# Altium schematic sheet Main.SchDoc
size A3; SheetNumber: 1
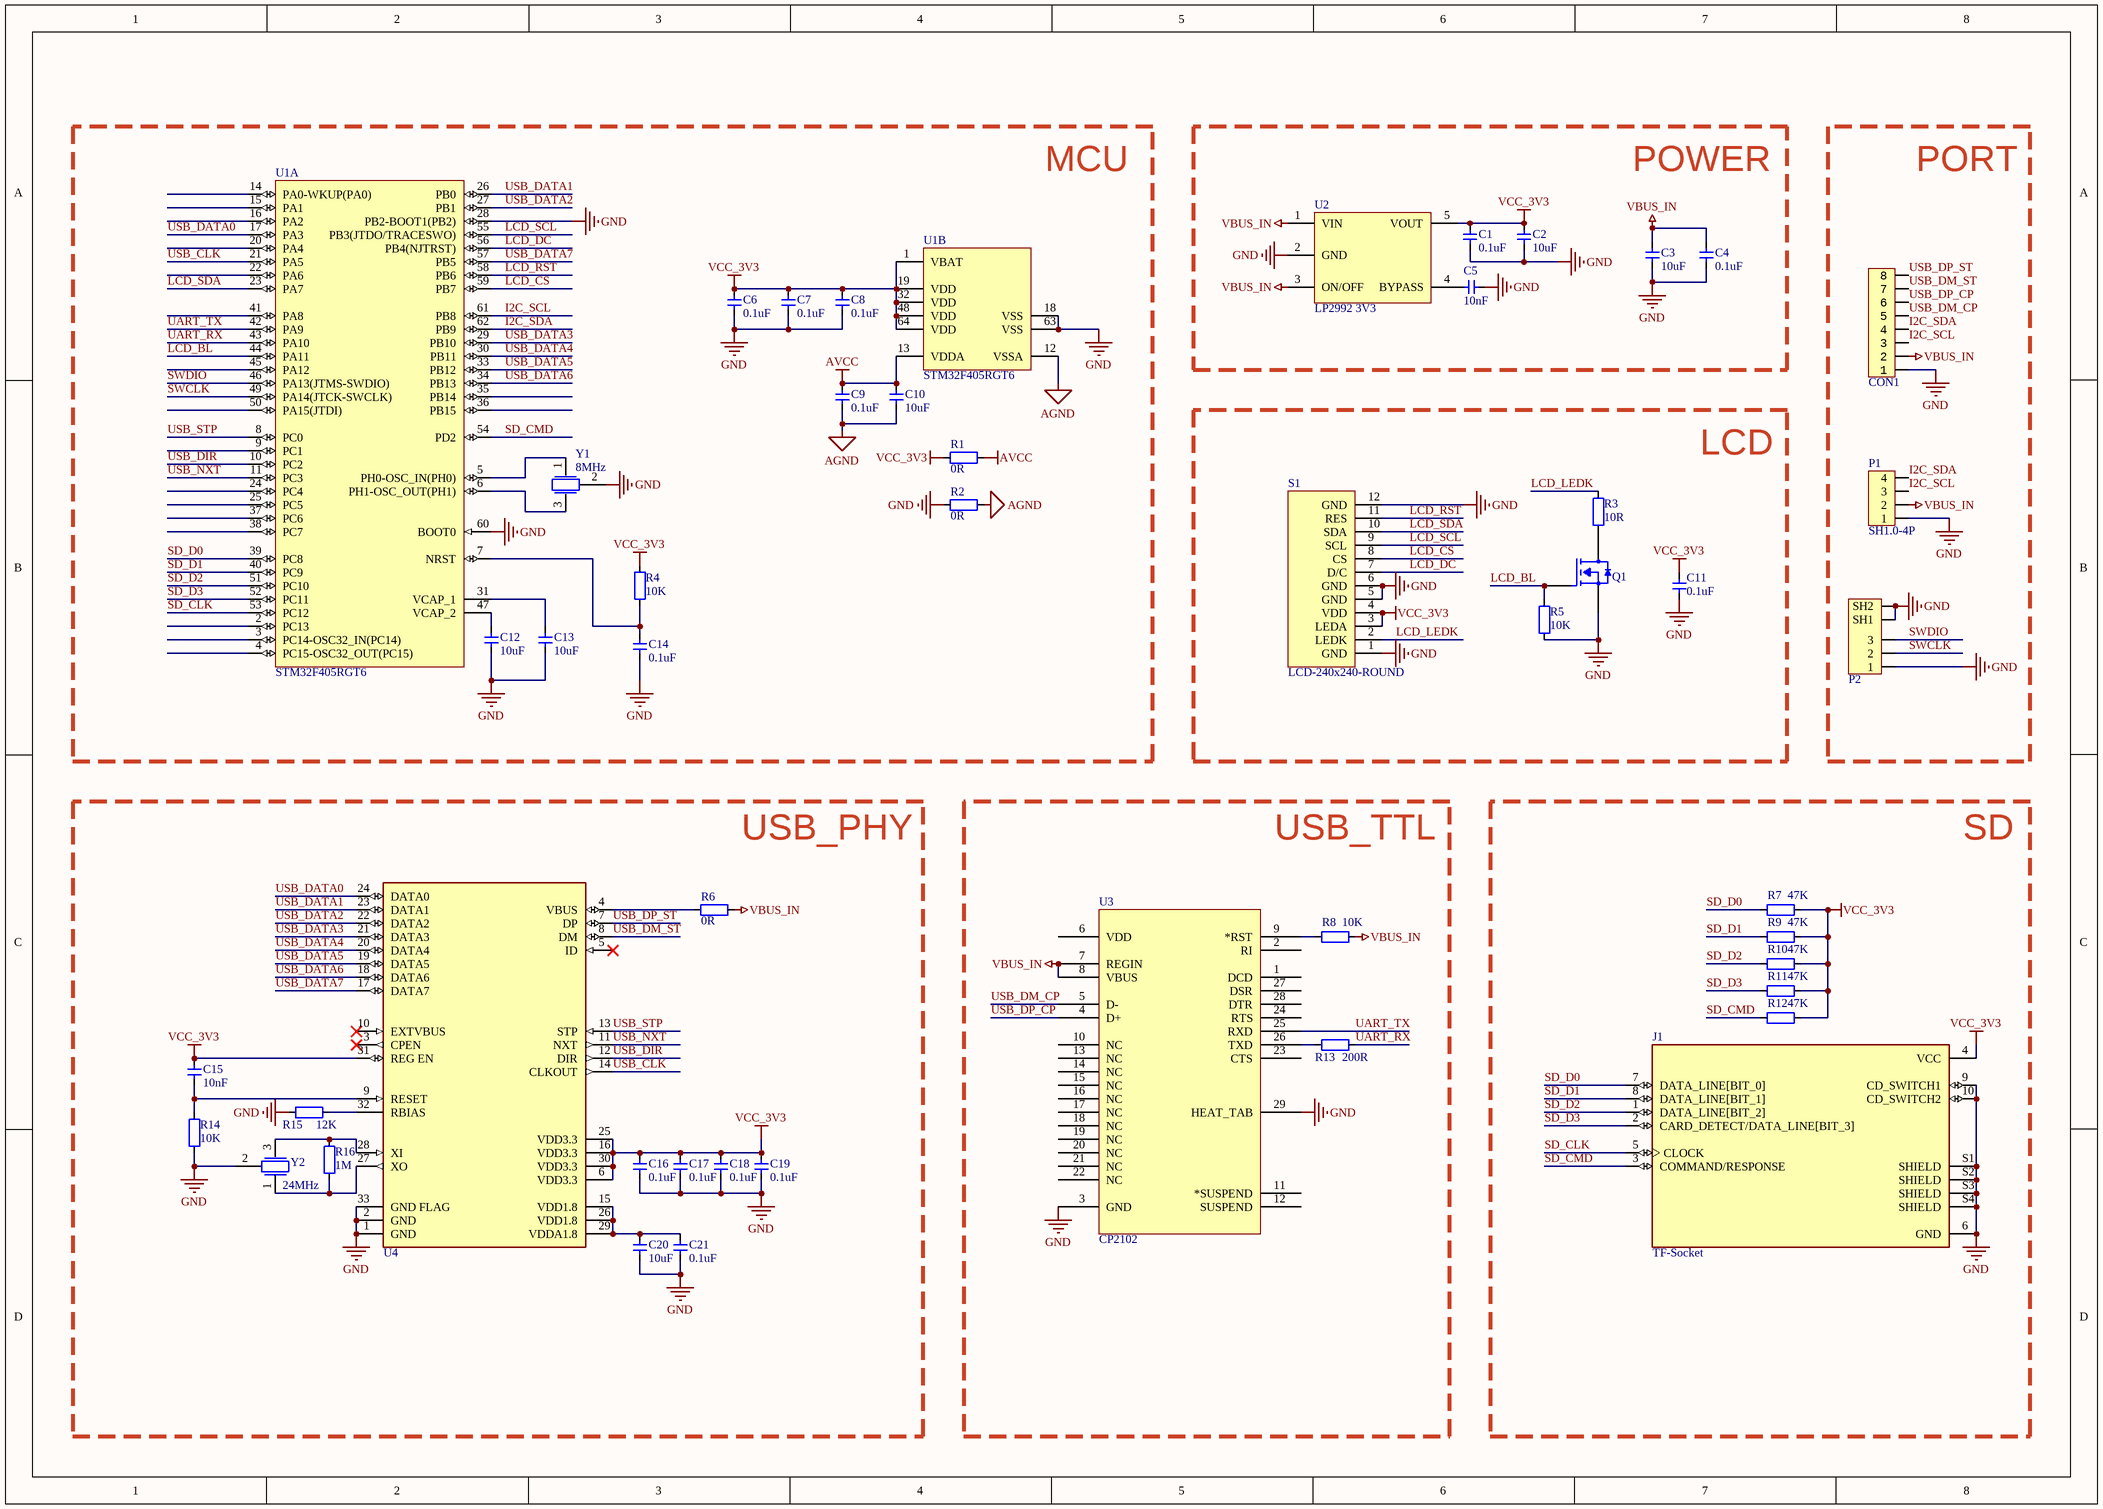
[diagram p0: Main.SchDoc]

## Parts
C1  0.1uF  [CAP_0402]
C2  10uF  [CAP_0402]
C3  10uF  [CAP_0402]
C4  0.1uF  [CAP_0402]
C5  10nF  [CAP_0402]
C6  0.1uF  [CAP_0402]
C7  0.1uF  [CAP_0402]
C8  0.1uF  [CAP_0402]
C9  0.1uF  [CAP_0402]
C10  10uF  [CAP_0402]
C11  0.1uF  [CAP_0402]
C12  10uF  [CAP_0402]
C13  10uF  [CAP_0402]
C14  0.1uF  [CAP_0402]
C15  10nF  [CAP_0402]
C16  0.1uF  [CAP_0402]
C17  0.1uF  [CAP_0402]
C18  0.1uF  [CAP_0402]
C19  0.1uF  [CAP_0402]
C20  10uF  [CAP_0402]
C21  0.1uF  [CAP_0402]
CON1  FFC_0.5_8  [FFC_0.5_8]  (value not drawn)
J1  TF-Socket  [TF-Card-Amphenol with TF]
P1  SH1.0-4P  [SH1.0-4P]
P2  SH1.0-3P-STAND  [SH1.0-3P-STAND]  (value not drawn)
Q1  AO3400A  [SOT23-3]  (value not drawn)
R1  0R  [RES_0402]
R2  0R  [RES_0402]
R3  10R  [RES_0402]
R4  10K  [RES_0402]
R5  10K  [RES_0402]
R6  0R  [RES_0402]
R7  47K  [RES_0402]
R8  10K  [RES_0402]
R9  47K  [RES_0402]
R10  47K  [RES_0402]
R11  47K  [RES_0402]
R12  47K  [RES_0402]
R13  200R  [RES_0402]
R14  10K  [RES_0402]
R15  12K  [RES_0402]
R16  1M  [RES_0402]
S1  LCD-240x240-ROUND  [LCD-240x240-ROUND]
U1  STM32F405RGT6  [LQFP-64_N]  (parts A,B of 2)
U2  LP2992 3V3  [SOT23-5]
U3  CP2102  [QFN-28]
U4  USB3300-EZK-TR  [QFN-32]  (value not drawn)
Y1  8MHz  [晶振-3P]
Y2  24MHz  [晶振-3P]

## Blocks framed on the sheet
MCU: C6-C10 C12-C14 R1 R2 R4 U1 Y1
POWER: C1-C5 U2
PORT: CON1 P1 P2
LCD: C11 Q1 R3 R5 S1
USB_PHY: C15-C21 R6 R14-R16 U4 Y2
USB_TTL: R8 R13 U3
SD: J1 R7 R9-R12

## Nets
AGND: C9.1 C10.1 R2.1 U1.12(VSSA)
AVCC: C9.2 C10.2 R1.1 U1.13(VDDA)
GND: C1.1 C2.1 C3.1 C4.1 C5.1 C6.1 C7.1 C8.1 C11.1 C12.1 C13.1 C14.1 C16.2 C17.2 C18.2 C19.2 C20.2 C21.2 CON1.1 J1.6(GND) J1.9(CD_SWITCH1) J1.10(CD_SWITCH2) J1.S1(SHIELD) J1.S2(SHIELD) J1.S3(SHIELD) J1.S4(SHIELD) P1.1 P2.1 P2.SH1 P2.SH2 Q1.2(S) R2.2 R5.1 R14.2 R15.2 S1.1(GND) S1.5(GND) S1.6(GND) S1.12(GND) U1.18(VSS) U1.28(PB2-BOOT1(PB2)) U1.60(BOOT0) U1.63(VSS) U2.2(GND) U3.3(GND) U3.29(HEAT_TAB) U4.1(GND) U4.2(GND) U4.33(GND_FLAG) Y1.2 Y2.2
VBUS_IN: C3.2 C4.2 CON1.2 P1.2 R6.1 R8.1 U2.1(VIN) U2.3(ON/OFF) U3.7(REGIN) U3.8(VBUS)
VCC_3V3: C1.2 C2.2 C6.2 C7.2 C8.2 C11.2 C15.1 C16.1 C17.1 C18.1 C19.1 J1.4(VCC) R1.2 R4.2 R7.1 R9.1 R10.1 R11.1 R12.1 S1.3(LEDA) S1.4(VDD) U1.1(VBAT) U1.19(VDD) U1.32(VDD) U1.48(VDD) U1.64(VDD) U2.5(VOUT) U4.6(VDD3.3) U4.16(VDD3.3) U4.25(VDD3.3) U4.30(VDD3.3) U4.31(REG_EN)
I2C_SCL: CON1.3 P1.3 U1.61(PB8)
I2C_SDA: CON1.4 P1.4 U1.62(PB9)
LCD_BL: Q1.1(G) R5.2 U1.44(PA11)
LCD_CS: S1.8(CS) U1.59(PB7)
LCD_DC: S1.7(D/C) U1.56(PB4(NJTRST))
LCD_LEDK: R3.2 S1.2(LEDK)
LCD_RST: S1.11(RES) U1.58(PB6)
LCD_SCL: S1.9(SCL) U1.55(PB3(JTDO/TRACESWO))
LCD_SDA: S1.10(SDA) U1.23(PA7)
SD_CLK: J1.5(CLOCK) U1.53(PC12)
SD_CMD: J1.3(COMMAND/RESPONSE) R12.2 U1.54(PD2)
SD_D0: J1.7(DATA_LINE[BIT_0]) R7.2 U1.39(PC8)
SD_D1: J1.8(DATA_LINE[BIT_1]) R9.2 U1.40(PC9)
SD_D2: J1.1(DATA_LINE[BIT_2]) R10.2 U1.51(PC10)
SD_D3: J1.2(CARD_DETECT/DATA_LINE[BIT_3]) R11.2 U1.52(PC11)
SWCLK: P2.2 U1.49(PA14(JTCK-SWCLK))
SWDIO: P2.3 U1.46(PA13(JTMS-SWDIO))
UART_RX: R13.1 U1.43(PA10)
UART_TX: U1.42(PA9) U3.25(RXD)
USB_CLK: U1.21(PA5) U4.14(CLKOUT)
USB_DATA0: U1.17(PA3) U4.24(DATA0)
USB_DATA1: U1.26(PB0) U4.23(DATA1)
USB_DATA2: U1.27(PB1) U4.22(DATA2)
USB_DATA3: U1.29(PB10) U4.21(DATA3)
USB_DATA4: U1.30(PB11) U4.20(DATA4)
USB_DATA5: U1.33(PB12) U4.19(DATA5)
USB_DATA6: U1.34(PB13) U4.18(DATA6)
USB_DATA7: U1.57(PB5) U4.17(DATA7)
USB_DIR: U1.10(PC2) U4.12(DIR)
USB_DM_CP: CON1.5 U3.5(D-)
USB_DM_ST: CON1.7 U4.8(DM)
USB_DP_CP: CON1.6 U3.4(D+)
USB_DP_ST: CON1.8 U4.7(DP)
USB_NXT: U1.11(PC3) U4.11(NXT)
USB_STP: U1.8(PC0) U4.13(STP)
NetC5_2: C5.2 U2.4(BYPASS)
NetC12_2: C12.2 U1.47(VCAP_2)
NetC13_2: C13.2 U1.31(VCAP_1)
NetC14_2: C14.2 R4.1 U1.7(NRST)
NetC15_2: C15.2 R14.1 U4.9(RESET)
NetC20_1: C20.1 C21.1 U4.15(VDD1.8) U4.26(VDD1.8) U4.29(VDDA1.8)
NetQ1_3: Q1.3(D) R3.1
NetR6_2: R6.2 U4.4(VBUS)
NetR8_2: R8.2 U3.9(*RST)
NetR13_2: R13.2 U3.26(TXD)
NetR15_1: R15.1 U4.32(RBIAS)
NetR16_1: R16.1 U4.28(XI) Y2.3
NetR16_2: R16.2 U4.27(XO) Y2.1
NetU1_5: U1.5(PH0-OSC_IN(PH0)) Y1.1
NetU1_6: U1.6(PH1-OSC_OUT(PH1)) Y1.3

Not connected (* = marked no-connect by the designer): U1 2(PC13) 3(PC14-OSC32_IN(PC14)) 4(PC15-OSC32_OUT(PC15)) 9(PC1) 14(PA0-WKUP(PA0)) 15(PA1) 16(PA2) 20(PA4) 22(PA6) 24(PC4) 25(PC5) 35(PB14) 36(PB15) 37(PC6) 38(PC7) 41(PA8) 45(PA12) 50(PA15(JTDI)); U3 1(DCD) 2(RI) 6(VDD) 10(NC) 11(*SUSPEND) 12(SUSPEND) 13(NC) 14(NC) 15(NC) 16(NC) 17(NC) 18(NC) 19(NC) 20(NC) 21(NC) 22(NC) 23(CTS) 24(RTS) 27(DSR) 28(DTR); U4 3(CPEN)* 5(ID)* 10(EXTVBUS)*

## Library data of the parts
C1-C21 = 电容-0402: Capacitor; Value: 0.1u
CON1 = FFC_0.5_8: FFC
J1 = TF-Socket: 10 _8 + 2_ Position Card Connector Secure Digital - microSDâ„¢ Surface Mount, Right Angle Gold; MP: 1140084168; MF: Amphenol Commercial Products; SnapEDA_Link: https://www.snapeda.com/parts/1140084168/Amphenol/view-part/4544529/?ref=snap; Availability: Unavailable; Price: None; Value: *; Package: None
P2 = SH1.0-3P-STAND: Header
Q1 = AO3400A: N-MOS
R1-R16 = 电阻-0402: Resistor; Value: 22R
S1 = LCD-240x240-ROUND: 显示屏
U1 = STM32F405RGT6: ARM Cortex-M4 32-bit MCU+FPU, 210 DMIPS, 1024 kB Flash, 192 kB Internal RAM, 51 I/Os, 64-pin LQFP, -40 to 85 degC, Tray; Manufacturer: STMicroelectronics; D/A Converter: 2x12-bit; FLASH Size (Prog) (kB): 1024; I/Os (High Current): 51; Internal RAM Size (kB): 192; Operating Frequency(F) (Processor speed) (MHz): 168; Supply Voltage(Vcc) max (V): 3.6; Supply Voltage(Vcc) min (V): 1.8; DatasheetVersion: Rev. 4; PackageVersion: Rev. 4, 06/2013; PackageReference: LQFP64; PackageDescription: 64-Pin Low Profile Quad Flat Package, 10 x 10 mm Body, 0.5 mm Pitch; Supplier 1: Digi-Key; Supplier Part Number 1: 497-11767-ND; Supplier 2: Farnell; Supplier Part Number 2: 2064363; Supplier 3: Newark; Supplier Part Number 3: 73T2329; Supplier 4: Mouser; Supplier Part Number 4: 511-STM32F405RGT6; Core: ARM Cortex-M4; Packing: Tray; Mounting Technology: Surface Mount; PartNumber: STM32F405RGT6; ComponentLink1Description: Manufacturer URL; ComponentLink1URL: http://www.st.com/web/en/home.html; ComponentLink2Description: Datasheet; ComponentLink2URL: http://www.st.com/st-web-ui/static/active/en/resource/technical/document/datasheet/DM00037051.pdf; ComponentLink3Description: Package Specification; ComponentLink3URL: http://www.st.com/st-web-ui/static/active/en/resource/technical/document/datasheet/DM00037051.pdf
U2 = LP2992: LDO
U3 = CP2102: USB转TTL; PART DESC: SINGLE-CHIP USB TO UART BRIDGE, QFN28, RoHS.; MFG #1: SILICON LABS; PART NUMBER: CP2102; Value: Value; RefDes: RefDes; Type: DEV
Y1 Y2 = 晶振-3Pin: 村田贴片